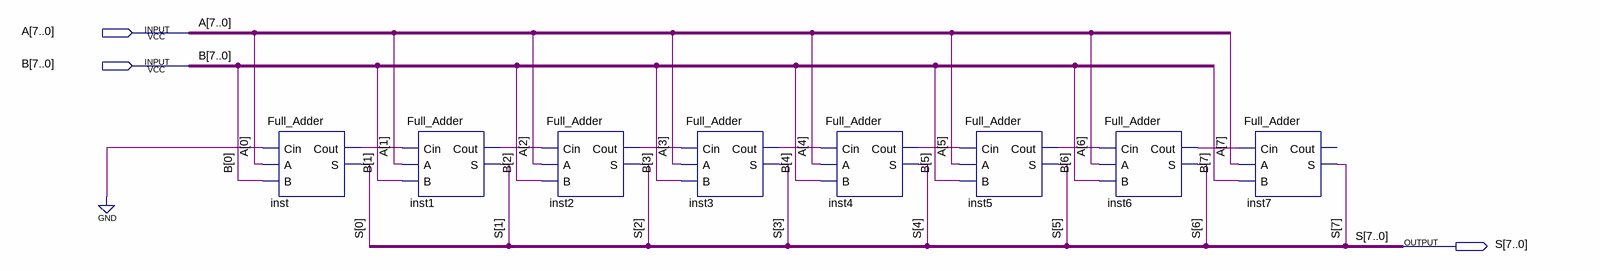
[diagram p0: schematic sheet]
// Quartus schematic ACongB_8Bit.bdf as structural Verilog: 8 symbols, 3 pins
module ACongB_8Bit (
  input  [7:0] A,
  input  [7:0] B,
  output [7:0] S
);

  wire inst1_cout, inst2_cout, inst3_cout, inst4_cout, inst5_cout, inst6_cout, inst_cout;

  Full_Adder inst (.Cin(1'b0), .A(A[0]), .B(B[0]), .Cout(inst_cout), .S(S[0]));
  Full_Adder inst1 (.Cin(inst_cout), .A(A[1]), .B(B[1]), .Cout(inst1_cout), .S(S[1]));
  Full_Adder inst2 (.Cin(inst1_cout), .A(A[2]), .B(B[2]), .Cout(inst2_cout), .S(S[2]));
  Full_Adder inst3 (.Cin(inst2_cout), .A(A[3]), .B(B[3]), .Cout(inst3_cout), .S(S[3]));
  Full_Adder inst4 (.Cin(inst3_cout), .A(A[4]), .B(B[4]), .Cout(inst4_cout), .S(S[4]));
  Full_Adder inst5 (.Cin(inst4_cout), .A(A[5]), .B(B[5]), .Cout(inst5_cout), .S(S[5]));
  Full_Adder inst6 (.Cin(inst5_cout), .A(A[6]), .B(B[6]), .Cout(inst6_cout), .S(S[6]));
  Full_Adder inst7 (.Cin(inst6_cout), .A(A[7]), .B(B[7]), .S(S[7]));  // open: Cout
endmodule
